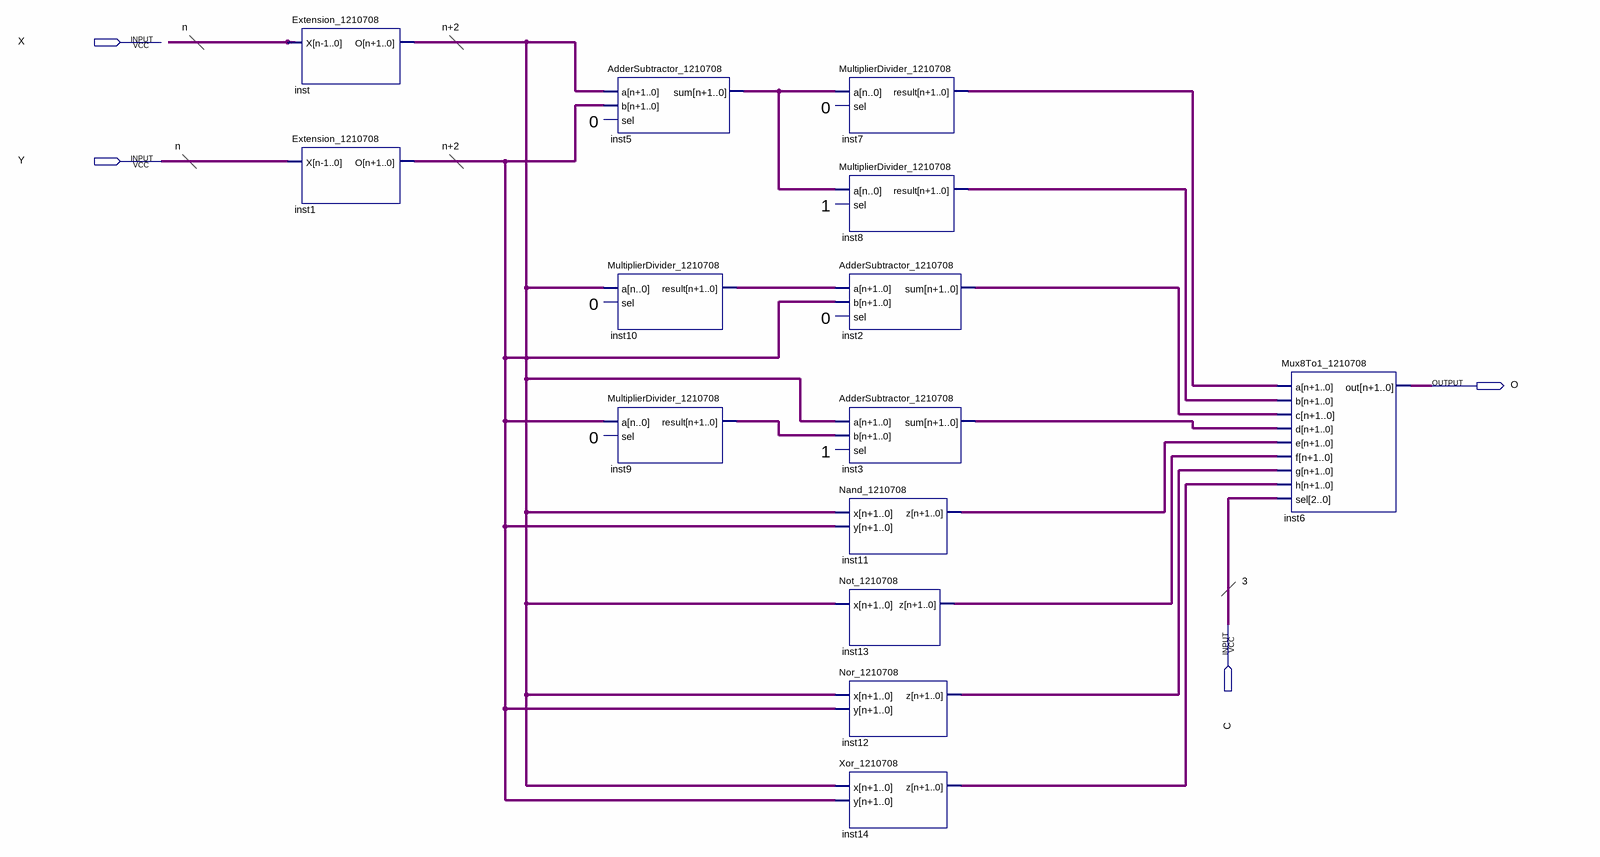
[diagram p0: schematic sheet]
// Quartus schematic Block_Diagram_1210708.bdf as structural Verilog: 14 symbols, 4 pins
module Block_Diagram_1210708 (
  input  X,
  input  Y,
  input  C,
  output O
);

  wire inst2_sum, inst3_sum, inst5_sum, inst7_result, inst8_result, inst9_result, inst10_result, inst11_z,
       inst12_z, inst13_z, inst14_z, inst_o, undriven_2;
  wire [2:0] undriven;

  Extension_1210708 inst (.X(undriven_2), .O(inst_o));
  Extension_1210708 inst1 (.X(Y), .O(inst_o));
  AdderSubtractor_1210708 inst5 (.a(inst_o), .b(inst_o), .sum(inst5_sum));  // open: sel
  MultiplierDivider_1210708 inst10 (.a(inst_o), .result(inst10_result));  // open: sel
  MultiplierDivider_1210708 inst9 (.a(inst_o), .result(inst9_result));  // open: sel
  MultiplierDivider_1210708 inst7 (.a(inst5_sum), .result(inst7_result));  // open: sel
  MultiplierDivider_1210708 inst8 (.a(inst5_sum), .result(inst8_result));  // open: sel
  AdderSubtractor_1210708 inst2 (.a(inst10_result), .b(inst_o), .sum(inst2_sum));  // open: sel
  AdderSubtractor_1210708 inst3 (.a(inst_o), .b(inst9_result), .sum(inst3_sum));  // open: sel
  Nand_1210708 inst11 (.x(inst_o), .y(inst_o), .z(inst11_z));
  Not_1210708 inst13 (.x(inst_o), .z(inst13_z));
  Nor_1210708 inst12 (.x(inst_o), .y(inst_o), .z(inst12_z));
  Xor_1210708 inst14 (.x(inst_o), .y(inst_o), .z(inst14_z));
  Mux8To1_1210708 inst6 (
    .a(inst7_result), .b(inst8_result), .c(inst2_sum), .d(inst3_sum), .e(inst11_z), .f(inst13_z),
    .g(inst12_z), .h(inst14_z), .sel(undriven), .out(O));

  // Notes on the sheet:
  //   n
  //   n+2
  //   0
  //   0
  //   n
  //   n+2
  //   1
  //   0
  //   0
  //   0
  //   1
  //   3
endmodule
